# Altium schematic sheet SRAM-SPI-FLASH.SchDoc
size A4; SheetNumber: 3; SheetTotal: 4
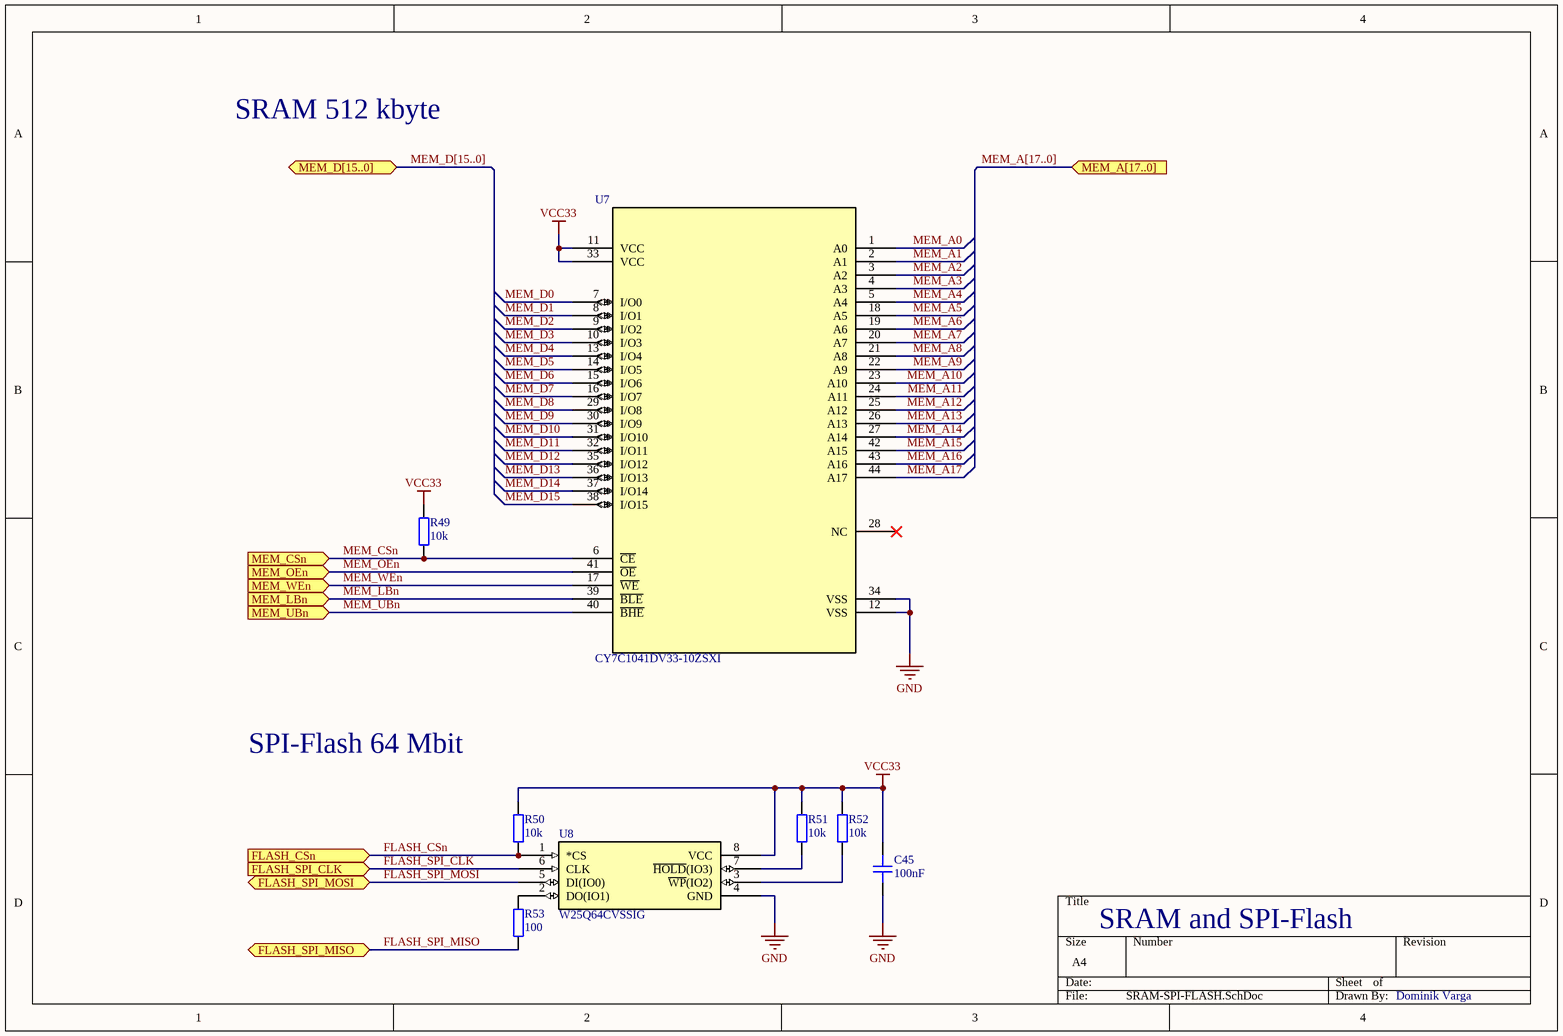
[diagram p0: SRAM-SPI-FLASH.SchDoc]

## Parts
C45  100nF  [CAP_SMD0603]
R49  10k  [RES_SMD0603]
R50  10k  [RES_SMD0603]
R51  10k  [RES_SMD0603]
R52  10k  [RES_SMD0603]
R53  100  [RES_SMD0603]
U7  CY7C1041DV33-10ZSXI  [SOP80P1184X119-44N]
U8  W25Q64CVSSIG  [SOIC127P790X216-8N]

## Ports
FLASH_CSn (in, see FPGA[5B]), FLASH_SPI_CLK (in, see FPGA[5A]), FLASH_SPI_MISO (bidir, see FPGA[5A]), FLASH_SPI_MOSI (bidir, see FPGA[5A]), MEM_A[17..0] (in, see FPGA[6B]), MEM_CSn (in, see FPGA[5B]), MEM_D[15..0] (bidir, see FPGA[6B]), MEM_LBn (in, see FPGA[3A]), MEM_OEn (in, see FPGA[3A]), MEM_UBn (in, see FPGA[3A]), MEM_WEn (in, see FPGA[5B])

## Nets
GND: C45.1 U7.12(VSS) U7.34(VSS) U8.4(GND)
VCC33: C45.2 R49.2 R50.2 R51.2 R52.2 U7.11(VCC) U7.33(VCC) U8.8(VCC)
FLASH_CSn: R50.1 U8.1(*CS) ; port FLASH_CSn
FLASH_SPI_CLK: U8.6(CLK) ; port FLASH_SPI_CLK
FLASH_SPI_MISO: R53.1 ; port FLASH_SPI_MISO
FLASH_SPI_MOSI: U8.5(DI(IO0)) ; port FLASH_SPI_MOSI
MEM_A0: U7.1(A0)
MEM_A1: U7.2(A1)
MEM_A2: U7.3(A2)
MEM_A3: U7.4(A3)
MEM_A4: U7.5(A4)
MEM_A5: U7.18(A5)
MEM_A6: U7.19(A6)
MEM_A7: U7.20(A7)
MEM_A8: U7.21(A8)
MEM_A9: U7.22(A9)
MEM_A10: U7.23(A10)
MEM_A11: U7.24(A11)
MEM_A12: U7.25(A12)
MEM_A13: U7.26(A13)
MEM_A14: U7.27(A14)
MEM_A15: U7.42(A15)
MEM_A16: U7.43(A16)
MEM_A17: U7.44(A17)
MEM_CSn: R49.1 U7.6(~{CE}) ; port MEM_CSn
MEM_D0: U7.7(I/O0)
MEM_D1: U7.8(I/O1)
MEM_D2: U7.9(I/O2)
MEM_D3: U7.10(I/O3)
MEM_D4: U7.13(I/O4)
MEM_D5: U7.14(I/O5)
MEM_D6: U7.15(I/O6)
MEM_D7: U7.16(I/O7)
MEM_D8: U7.29(I/O8)
MEM_D9: U7.30(I/O9)
MEM_D10: U7.31(I/O10)
MEM_D11: U7.32(I/O11)
MEM_D12: U7.35(I/O12)
MEM_D13: U7.36(I/O13)
MEM_D14: U7.37(I/O14)
MEM_D15: U7.38(I/O15)
MEM_LBn: U7.39(~{BLE}) ; port MEM_LBn
MEM_OEn: U7.41(~{OE}) ; port MEM_OEn
MEM_UBn: U7.40(~{BHE}) ; port MEM_UBn
MEM_WEn: U7.17(~{WE}) ; port MEM_WEn
NetR51_1: R51.1 U8.7(~{HOLD}(IO3))
NetR52_1: R52.1 U8.3(~{WP}(IO2))
NetR53_2: R53.2 U8.2(DO(IO1))

Not connected (* = marked no-connect by the designer): U7 28(NC)*

## Buses and harness runs
bus MEM_A[17..0] = port MEM_A[17..0]
bus MEM_D[15..0] = port MEM_D[15..0]

## Notes on the sheet
- SRAM 512 kbyte
- SPI-Flash 64 Mbit
- SRAM and SPI-Flash
- Dominik Varga

## Library data of the parts
C45 = CAP_0603: Capacitor SMD 0603
R49-R53 = RES_0603: Resistor SMD 0603
U7 = CY7C1041DV33-10ZSXI: SRAM Chip Asynchronous Single 3.3V 4M-Bit 256K x 16 10ns 44-Pin TSOP-II Tray; Mfr_Name: Cypress Semiconductor; Copyright: Copyright (C) 2023 Ultra Librarian. All rights reserved.; Manufacturer_Part_Number: CY7C1041DV33-10ZSXI; RefDes: RefDes; Type: DEV
U8 = W25Q64CVSSIG: SERIAL FLASH MEMORY WITH   DUAL AND QUAD SPI; Mfr_Name: Winbond; Copyright: Copyright (C) 2023 Ultra Librarian. All rights reserved.; Manufacturer_Part_Number: W25Q64CVSSIG; RefDes: RefDes; Type: DEV